# EAGLE design simple-loop-active4 (EAGLE 6.6.0)

## Sheet 1 of 2
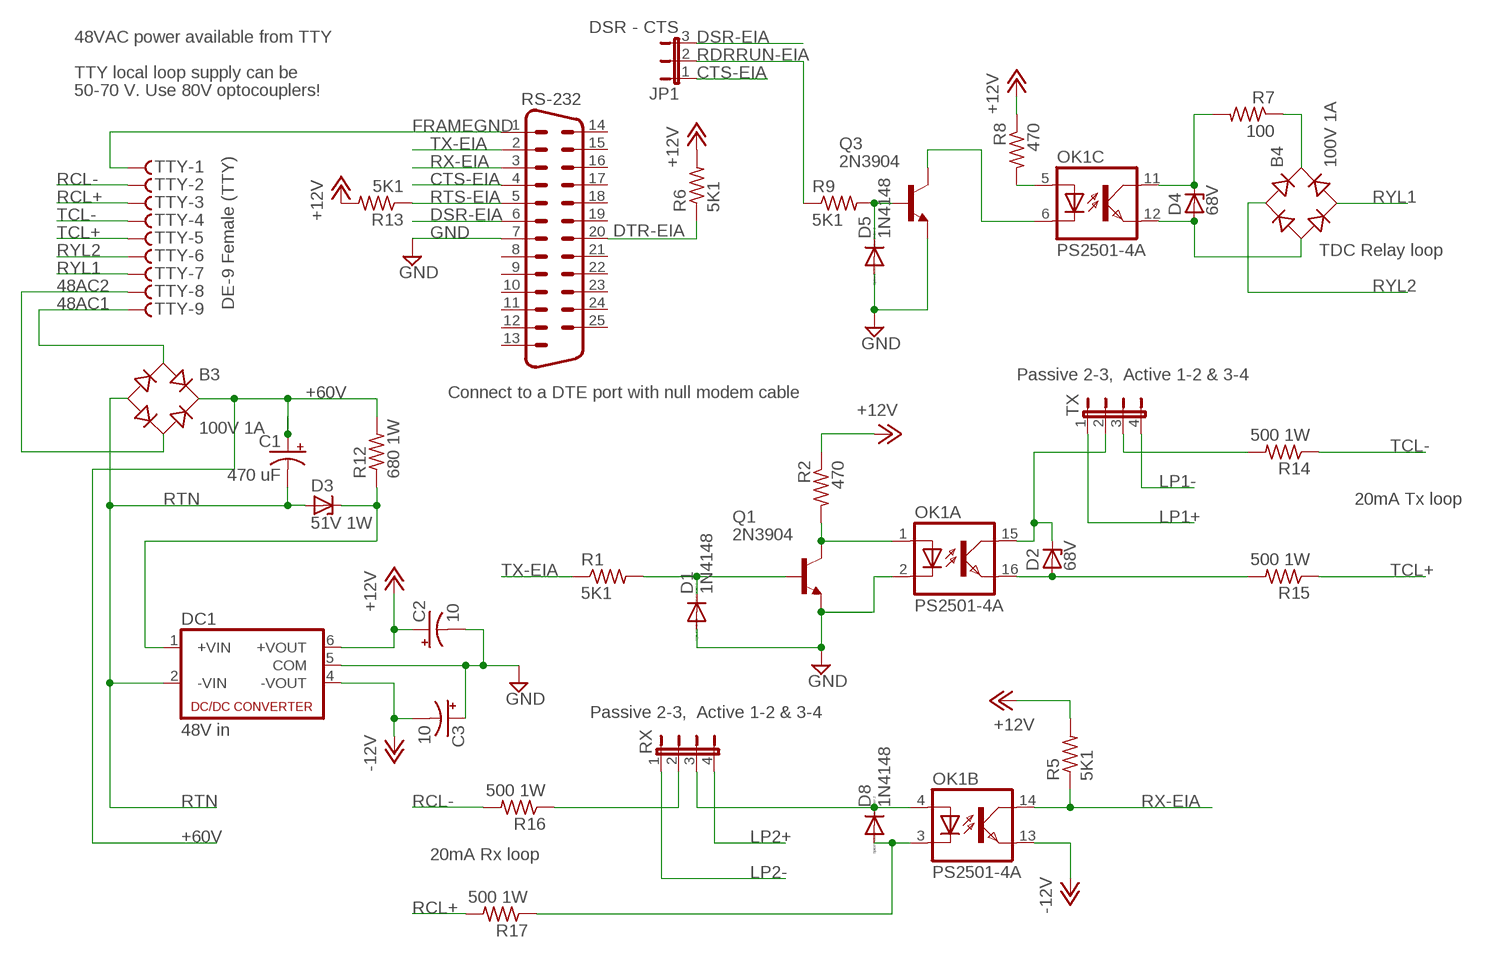
[diagram p0: schematic, sheet 1]

### Parts
B3  100V 1A  RB1A  [RB1A]
B4  100V 1A  RB1A  [RB1A]
C1  470 uF  CPOL-USE7.5-18  [E7,5-18]
C2  10  CPOL-USB45181A  [B45181A]
C3  10  CPOL-USB45181A  [B45181A]
D1  1N4148  1N4148DO35-10  [DO35-10]
D2  68V  ZENER-DIODEDO41Z10  [DO41Z10]
D3  51V 1W  ZENER-DIODEDO41Z10  [DO41Z10]
D4  68V  ZENER-DIODEDO41Z10  [DO41Z10]
D5  1N4148  1N4148DO35-10  [DO35-10]
D8  1N4148  1N4148DO35-10  [DO35-10]
DC1  48V in  NMA  [NMA]
JP1  DSR - CTS  JP2E  [JP2]
OK1  PS2501-4A  ILQ1  [DIL16]
Q1  2N3904  [TO92]
Q3  2N3904  [TO92]
R1  5K1  R-US_0207/10  [0207/10]
R2  470  R-US_0207/10  [0207/10]
R5  5K1  R-US_0207/10  [0207/10]
R6  5K1  R-US_0207/10  [0207/10]
R7  100  R-US_0207/10  [0207/10]
R8  470  R-US_0207/10  [0207/10]
R9  5K1  R-US_0207/10  [0207/10]
R12  680 1W  R-US_0817/7V  [P0817V]
R13  5K1  R-US_0207/10  [0207/10]
R14  500 1W  R-US_0817/7V  [P0817V]
R15  500 1W  R-US_0817/7V  [P0817V]
R16  500 1W  R-US_0817/7V  [P0817V]
R17  500 1W  R-US_0817/7V  [P0817V]
RS-232  M25H  [M25H]
RX  JP4E  [JP4]
TTY  F09HS  [F09H]
TX  JP4E  [JP4]

### Nets
48AC1: B3.AC1 TTY.9
48AC2: B3.AC2 TTY.8
+12V: C2.+ DC1.6(+VOUT) R2.1 R5.2 R6.2 R8.1 R13.2
+48VDC: D3.C DC1.1(+VIN) R12.1
+60V: B3.+ C1.+ R12.2 ; also sheet 2
-12V: C3.- DC1.4(-VOUT) OK1.13(B:EMIT)
CTS-EIA: JP1.1 RS-232.4
DSR-EIA: JP1.3 RS-232.6
DTR-EIA: R6.1 RS-232.20
FRAMEGND: RS-232.1 TTY.1
GND [GND]: C2.- C3.+ D1.A D5.A DC1.5(COM) OK1.2(A:C) Q1.3(E) Q3.3(E) RS-232.7
LP1+: TX.1 ; also sheet 2
LP1-: TX.4 ; also sheet 2
LP2+: RX.4 ; also sheet 2
LP2-: RX.1 ; also sheet 2
N$1: D8.C OK1.4(B:A) RX.3
N$2: R16.1 RX.2
N$3: D8.A OK1.3(B:C) R17.1
N$4: D2.A OK1.16(A:EMIT) R15.2
N$5: OK1.5(C:A) R8.2
N$6: D2.C OK1.15(A:COL) TX.2
N$7: D1.C Q1.2(B) R1.2
N$9: OK1.1(A:A) Q1.1(C) R2.2
N$11: D4.C OK1.11(C:COL) R7.2
N$12: B4.- D4.A OK1.12(C:EMIT)
N$13: B4.+ R7.1
N$15: OK1.6(C:C) Q3.1(C)
N$16: D5.C Q3.2(B) R9.2
N$19: R14.2 TX.3
RCL+: R17.2 TTY.3
RCL-: R16.2 TTY.2
RDRRUN-EIA: JP1.2 R9.1
RTN: B3.- C1.- D3.A DC1.2(-VIN) ; also sheet 2
RTS-EIA: R13.1 RS-232.5
RX-EIA: OK1.14(B:COL) R5.1 RS-232.3
RYL1: B4.AC2 TTY.7
RYL2: B4.AC1 TTY.6
TCL+: R15.1 TTY.5
TCL-: R14.1 TTY.4
TX-EIA: R1.1 RS-232.2
Unconnected: RS-232.8 RS-232.9 RS-232.10 RS-232.11 RS-232.12 RS-232.13 RS-232.14 RS-232.15 RS-232.16 RS-232.17 RS-232.18 RS-232.19 RS-232.21 RS-232.22 RS-232.23 RS-232.24 RS-232.25

### Notes on the sheet
- 48VAC power available from TTY
- TTY local loop supply can be
- 50-70 V. Use 80V optocouplers!
- TDC Relay loop
- DE-9 Female (TTY)
- Passive 2-3,  Active 1-2 & 3-4
- Connect to a DTE port with null modem cable
- 20mA Tx loop
- Passive 2-3,  Active 1-2 & 3-4
- 20mA Rx loop

## Sheet 2 of 2
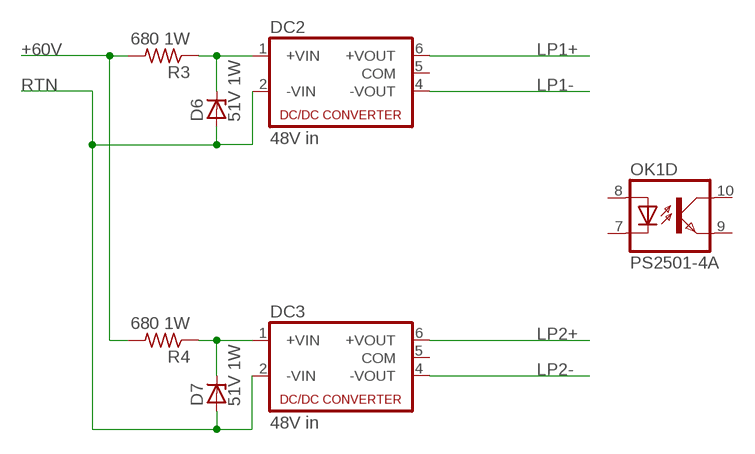
[diagram p1: schematic, sheet 2]

### Parts
D6  51V 1W  ZENER-DIODEDO41Z10  [DO41Z10]
D7  51V 1W  ZENER-DIODEDO41Z10  [DO41Z10]
DC2  48V in  NMA  [NMA]
DC3  48V in  NMA  [NMA]
R3  680 1W  R-US_0817/7V  [P0817V]
R4  680 1W  R-US_0817/7V  [P0817V]

### Nets
+48VDC1: D6.C DC2.1(+VIN) R3.1
+48VDC2: D7.C DC3.1(+VIN) R4.1
+60V: R3.2 R4.2 ; also sheet 1
LP1+: DC2.6(+VOUT) ; also sheet 1
LP1-: DC2.4(-VOUT) ; also sheet 1
LP2+: DC3.6(+VOUT) ; also sheet 1
LP2-: DC3.4(-VOUT) ; also sheet 1
RTN: D6.A D7.A DC2.2(-VIN) DC3.2(-VIN) ; also sheet 1
Unconnected: DC2.5(COM) DC3.5(COM) OK1.7(D:C) OK1.8(D:A) OK1.9(D:EMIT) OK1.10(D:COL)

## Library data of the parts
B3 B4 = rectifier:RB1A: RECTIFIER 1 A
C1-C3 = rcl:CPOL-US: POLARIZED CAPACITOR, American symbol
D1 D5 D8 = diode:1N4148: DIODE high speed (Philips)
D2-D4 D6 D7 = diode:ZENER-DIODE: Z-Diode
DC1-DC3 = dc-dc-converter:NMA: DC-DC CONVERTER; MF: C & D TECHNOLOGIES, INC; MPN: NMA0515SC; OC_FARNELL: 1021434; OC_NEWARK: 61K3064
JP1 = jumper:JP2E: JUMPER
OK1 = optocoupler:ILQ1: SIEMENS OPTO COUPLER; MF: VISHAY/TELEFUNKEN; MPN: ILQ1; OC_FARNELL: 1469501; OC_NEWARK: 88K1954
Q1 Q3 = transistor-npn:2N3904: NPN Transistor
R1-R9 R12-R17 = rcl:R-US_: RESISTOR, American symbol
RS-232 = con-subd:M25: SUB-D; OC_FARNELL: unknown; OC_NEWARK: unknown
RX TX = jumper:JP4E: JUMPER
TTY = con-subd:F09?S: SUB-D; OC_FARNELL: unknown; OC_NEWARK: unknown

## Net classes
1 GND: width 0.508 mm

## Board
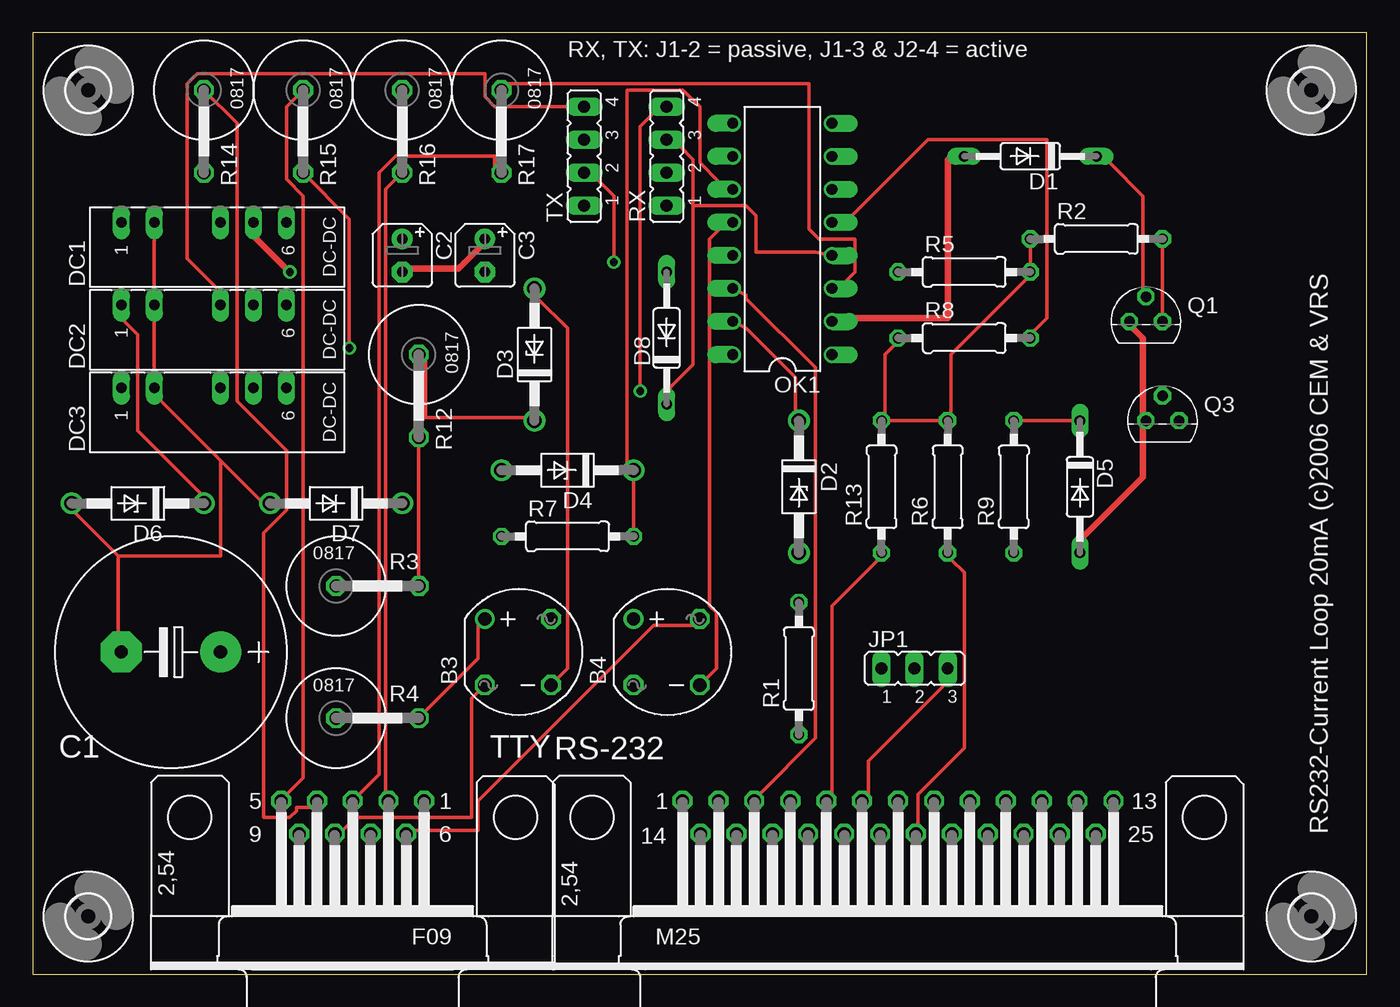
[diagram p2: board, top side]
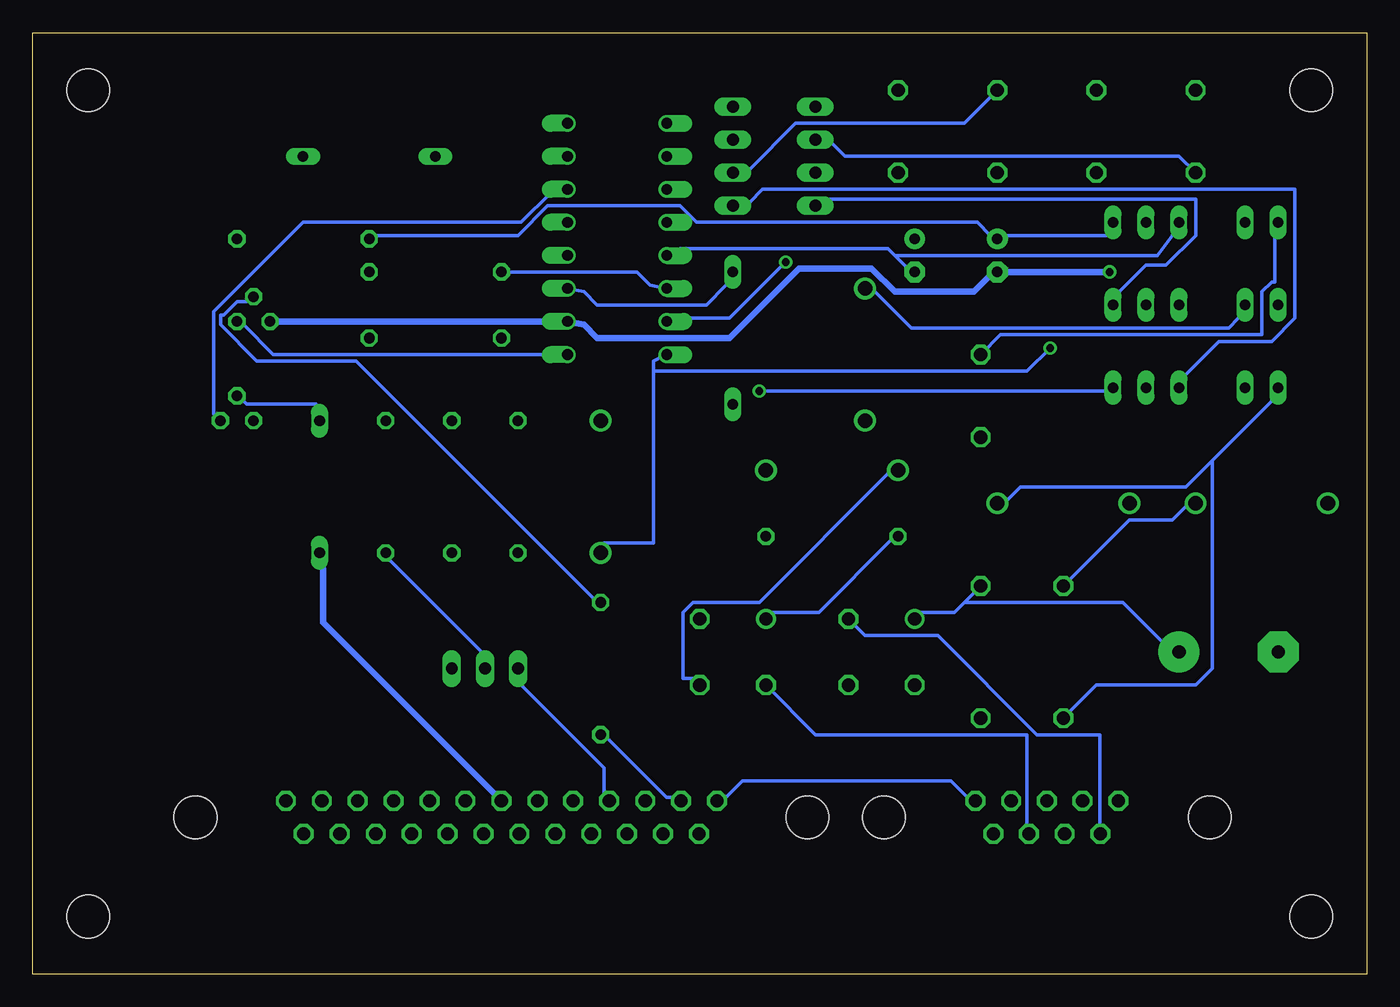
[diagram p3: board, bottom side, seen from below]

Size 102.54 x 72.37 mm. Coordinates in mm from the lower left corner, seen from the top.
Outline: 102.54,0 102.54,72.37 0,72.37 0,0 102.54,0
Copper layers (1*16): Top 0.035mm / dielectric 1.5mm / Bottom 0.035mm
Design rules "10mils *": minimum track width 10mil, minimum drill 24mil, track to track 10mil, track to pad 10mil, pad to pad 10mil, via to via 10mil, smd to smd 10mil, copper to edge 40mil, drill to drill 10mil, minimum pad ring 10mil, minimum via ring 8mil, stop-mask expansion 0mil, vias tented up to drill 0mil, thermal gap 10mil

### Footprints (pad centres in the part's own frame; a part is rotated, then mirrored left to right if it is on the bottom)
RB1A = drill 1.016: + -2.54,2.54 | drill 1.016 octagon: - 2.54,-2.54; AC1 2.54,2.54; AC2 -2.54,-2.54
E7,5-18 = drill 1.016 pad 3.15: + -3.81,0 | drill 1.016 pad 3.15 octagon: - 3.81,0
B45181A = drill 0.813 pad 1.6: + -1.27,0 | drill 0.813 pad 1.6 octagon: - 1.27,0
DO35-10 = drill 0.813 long: A 5.08,0; C -5.08,0
DO41Z10 = drill 1.118: A 5.08,0; C -5.08,0
NMA = drill 0.813 long: 1 0,6.35; 2 0,3.81; 4 0,-1.27; 5 0,-3.81; 6 0,-6.35
JP2 = drill 0.914 long: 1 -2.54,0; 2 0,0; 3 2.54,0
DIL16 = drill 0.813 offset: 1 -8.89,-3.81; 2 -6.35,-3.81; 3 -3.81,-3.81; 4 -1.27,-3.81; 5 1.27,-3.81; 6 3.81,-3.81; 7 6.35,-3.81; 8 8.89,-3.81; 9 8.89,3.81; 10 6.35,3.81; 11 3.81,3.81; 12 1.27,3.81; 13 -1.27,3.81; 14 -3.81,3.81; 15 -6.35,3.81; 16 -8.89,3.81
TO92 = drill 0.813 octagon: 1 1.27,0; 2 0,1.905; 3 -1.27,0
0207/10 = drill 0.813 octagon: 1 -5.08,0; 2 5.08,0
P0817V = drill 1.016 octagon: 1 -5.08,0; 2 1.27,0
M25H = drill 1.016 octagon: 1 -16.561,1.27; 2 -13.792,1.27; 3 -11.049,1.27; 4 -8.28,1.27; 5 -5.512,1.27; 6 -2.769,1.27; 7 0,1.27; 8 2.769,1.27; 9 5.512,1.27; 10 8.28,1.27; 11 11.049,1.27; 12 13.792,1.27; 13 16.561,1.27; 14 -15.189,-1.27; 15 -12.421,-1.27; 16 -9.652,-1.27; 17 -6.909,-1.27; 18 -4.14,-1.27; 19 -1.372,-1.27; 20 1.372,-1.27; 21 4.14,-1.27; 22 6.909,-1.27; 23 9.652,-1.27; 24 12.421,-1.27; 25 15.189,-1.27 | hole 3.302: 23.52,0; -23.52,0
JP4 = drill 0.914 long: 1 -3.81,0; 2 -1.27,0; 3 1.27,0; 4 3.81,0
F09H = drill 1.016 octagon: 1 -5.486,-1.27; 2 -2.743,-1.27; 3 0,-1.27; 4 2.743,-1.27; 5 5.486,-1.27; 6 -4.115,1.27; 7 -1.372,1.27; 8 1.372,1.27; 9 4.115,1.27 | hole 3.302: -12.522,0; 12.522,0
3,3 = hole 3.3: 0,0

### Placement (x,y rotation side)
B3  37.3,24.76 0 top
B4  48.73,24.76 0 top
C1  10.63,24.76 180 top
C2  28.41,55.24 270 top
C3  34.76,55.24 270 top
D1  76.67,62.86 180 top
D2  58.89,37.46 270 top
D3  38.57,47.62 90 top
D4  41.11,38.73 180 top
D5  80.48,37.46 270 top
D6  8.09,36.19 180 top
D7  23.33,36.19 180 top
D8  48.73,48.89 90 top
DC1  13.17,57.78 90 top
DC2  13.17,51.43 90 top
DC3  13.17,45.08 90 top
JP1  67.78,23.49 0 top
OK1  57.62,56.51 90 top
Q1  85.56,50.16 0 top
Q3  86.83,42.54 0 top
R1  58.89,23.49 90 top
R2  81.75,56.51 0 top
R3  28.41,29.84 0 top
R4  28.41,19.68 0 top
R5  71.59,53.97 0 top
R6  70.32,37.46 90 top
R7  41.11,33.65 0 top
R8  71.59,48.89 0 top
R9  75.4,37.46 90 top
R12  29.68,42.54 270 top
R13  65.24,37.46 90 top
R14  13.17,62.86 270 top
R15  20.79,62.86 270 top
R16  28.41,62.86 270 top
R17  36.03,62.86 270 top
RS-232  66.51,12.06 0 top
RX  48.73,62.86 90 top
TTY  24.6,12.06 180 top
TX  42.38,62.86 90 top
U$1  [3,3]  4.28,67.94 0 top
U$2  [3,3]  4.28,4.44 0 top
U$3  [3,3]  98.26,67.94 0 top
U$4  [3,3]  98.26,4.44 0 top

### Tracks (layer width: path | path; a pad name or v marks a point on that pad's centre or on a via)
48AC1
  Bottom 0.254: TTY.9 20.54,11.3 20.54,18.41 25.36,18.41 32.98,26.03 38.57,26.03 B3.AC1
48AC2
  Top 0.254: TTY.8 23.84,11.04 24.85,12.06 33.74,12.06 33.74,21.2 B3.AC2
+12V
  Top 0.254: R2.1 R5.2 76.42,53.46 70.57,47.62 70.57,43.05 R6.2 R13.2 65.49,43.05 65.49,47.62 66.26,48.38 R8.1
  Bottom 0.254: DC1.6 20.03,56.76 27.9,56.76 C2.+ 28.92,56.76 29.93,57.78 51.52,57.78 52.79,59.05 62.95,59.05 65.24,56.76 76.16,56.76 R2.1
+48VDC
  Top 0.254: D3.C 37.81,42.79 30.19,42.79 30.19,47.11 R12.1
  Bottom 0.254: DC1.1 7.07,56.51 7.07,53.21 7.33,53.21 8.09,52.45 8.09,49.14 28.16,49.14 R12.1
+48VDC1
  Top 0.254: DC2.1 7.07,50.16 8.09,49.14 8.09,41.78 12.92,36.95 D6.C
  Bottom 0.254: R3.1 18.25,34.92 14.95,34.92 13.93,35.94 D6.C
+48VDC2
  Bottom 0.254: 11.9,39.49 13.93,37.46 26.63,37.46 27.65,36.44 D7.C | 11.9,39.49 7.33,44.06 DC3.1 | 11.9,39.49 11.9,23.49 13.17,22.22 20.79,22.22 R4.1
+60V
  Top 0.254: R4.2 34.25,24.25 34.25,26.79 B3.+ | R3.2 R12.2
  Bottom 0.254: 30.95,28.57 31.71,27.81 34.25,27.81 B3.+ | 30.95,28.57 R3.2 | 30.95,28.57 18.76,28.57 15.2,25.01 C1.+
-12V
  Bottom 0.254: 36.28,55.24 36.79,55.75 52.79,55.75 OK1.13 | 36.28,55.24 35.27,54.22 C3.- | 36.28,55.24 16.09,55.24 14.95,56.76 DC1.4
CTS-EIA
  Bottom 0.254: JP1.1 64.99,22.22 58.64,15.87 58.64,13.84 RS-232.4
DSR-EIA
  Top 0.254: JP1.3 70.07,22.22 64.22,16.38 64.22,13.84 RS-232.6
DTR-EIA
  Top 0.254: R6.1 70.57,31.87 71.59,30.86 71.59,17.39 68.03,13.84 68.03,11.3 RS-232.20
FRAMEGND
  Bottom 0.254: TTY.1 30.7,13.58 31.97,14.85 47.97,14.85 49.24,13.58 RS-232.1
GND  (via drill 0.61)
  Top 0.508: D5.A 80.73,33.65 85.31,38.22 85.31,42.03 Q3.3 85.31,43.05 85.31,48.89 84.54,49.65 Q1.3 | C2.- 28.92,54.22 32.73,54.22 34.51,56 C3.+ | v19.77,53.97 17.23,56.51 DC1.5 | OK1.2 62.7,50.41 70.32,50.41 70.32,62.61 D1.A
  Bottom 0.508: RS-232.7 80.23,27.05 80.23,31.11 D5.A | v19.77,53.97 C2.- 28.92,53.72 30.19,52.45 36.28,52.45 38.06,54.22 43.65,54.22 48.98,48.89 59.14,48.89 60.16,49.91 OK1.2 Q1.3
LP1+
  Bottom 0.254: DC2.6 19.01,52.45 16.98,54.48 15.46,54.48 13.17,56.76 13.17,59.56 41.36,59.56 TX.1
LP1-
  Top 0.254: DC2.4 14.19,52.7 11.9,54.99 11.9,68.45 12.66,69.21 34.76,69.21 34.76,67.43 35.52,66.67 TX.4
LP2+  (via drill 0.61)
  Top 0.254: v46.7,44.83 46.7,65.15 47.71,66.16 RX.4
  Bottom 0.254: v46.7,44.83 20.03,44.83 DC3.6
LP2-
  Bottom 0.254: DC3.4 13.93,46.1 11.39,48.64 7.33,48.64 5.55,50.41 5.55,60.32 46.44,60.32 47.46,59.3 RX.1
N$1
  Top 0.254: 50.76,59.05 50.76,62.61 49.75,63.62 RX.3 | 50.76,59.05 50.76,46.86 48.98,45.08 D8.C | 50.76,59.05 54.83,59.05 55.59,58.29 55.59,55.49 60.16,55.49 OK1.4
N$2
  Bottom 0.254: RX.2 47.46,61.84 43.9,65.4 30.95,65.4 R16.1
N$3
  Top 0.254: R17.1 36.54,68.45 59.65,68.45 59.65,57.27 60.41,56.51 63.21,56.51 63.21,53.97 62.45,53.21 OK1.3
  Bottom 0.254: D8.A 49.24,52.95 50.76,51.43 59.14,51.43 60.16,52.45 OK1.3
N$4  (via drill 0.61)
  Top 0.254: v24.35,48.13 24.35,58.03 R15.2
  Bottom 0.254: 54.83,46.35 54.83,33.14 58.64,33.14 D2.A | 54.83,46.35 54.83,47.11 OK1.16 | v24.35,48.13 26.12,46.35 54.83,46.35
N$5
  Top 0.254: OK1.5 62.7,58.03 68.8,64.13 77.94,64.13 77.94,50.41 76.92,49.4 R8.2
N$6  (via drill 0.61)
  Top 0.254: OK1.15 54.83,49.65 58.64,45.84 58.64,43.3 D2.C | v44.67,54.73 44.67,59.81 43.4,61.08 TX.2
  Bottom 0.254: v44.67,54.73 48.98,50.41 52.54,50.41 OK1.15
N$7
  Top 0.254: D1.C 82.77,62.35 85.31,59.81 85.31,52.7 Q1.2
  Bottom 0.254: R1.2 59.4,28.82 77.69,47.11 85.31,47.11 88.1,49.91 88.1,50.67 87.85,50.67 86.83,51.68 86.07,51.68 Q1.2
N$9
  Top 0.254: Q1.1 R2.2
  Bottom 0.254: OK1.1 84.04,47.62 86.32,49.91 Q1.1
N$11
  Top 0.254: R7.2 D4.C 45.68,39.24 45.68,67.94 50,67.94 51.27,66.67 51.27,62.35 52.79,60.83 OK1.11
N$12
  Top 0.254: OK1.12 52.79,57.27 52.03,56.51 52.03,28.32 52.54,27.81 52.54,23.49 B4.-
  Bottom 0.254: D4.A 36.79,38.48 46.7,28.57 51.78,28.57 52.54,27.81 52.54,22.73 51.78,22.73 B4.-
N$13
  Bottom 0.254: R7.1 36.54,33.4 42.13,27.81 45.68,27.81 B4.+
N$15
  Bottom 0.254: OK1.6 62.7,60.07 64.99,57.78 81.75,57.78 88.61,50.92 88.61,43.05 88.35,43.05 Q3.1
N$16
  Top 0.254: R9.2 D5.C
  Bottom 0.254: Q3.2 86.32,44.06 86.07,43.81 80.73,43.81 D5.C
N$19
  Bottom 0.254: TX.3 41.11,63.88 40.09,62.86 14.44,62.86 R14.2
RCL+
  Top 0.254: TTY.3 26.63,15.36 26.63,61.59 27.9,62.86 35.52,62.86 35.52,62.1 R17.2
RCL-
  Top 0.254: TTY.2 27.14,13.84 27.14,60.32 R16.2
RDRRUN-EIA
  Bottom 0.254: R9.1 75.15,31.87 68.03,24.76 JP1.2
RTN
  Top 0.254: B3.- 41.11,23.49 41.11,49.65 38.82,51.94 D3.A | 6.57,32.13 3.26,35.43 D6.A | 6.57,32.13 6.57,25.52 C1.- | DC1.2 DC2.2 DC3.2 9.87,44.06 14.44,39.49 | 14.44,39.49 17.49,36.44 D7.A | 6.57,32.13 14.44,32.13 14.44,39.49
  Bottom 0.254: D3.A 37.81,52.45 35.01,49.65 10.63,49.65 9.87,50.41 DC2.2
RTS-EIA
  Top 0.254: R13.1 64.99,31.87 61.43,28.32 61.43,13.84 RS-232.5
RX-EIA
  Top 0.254: RS-232.3 55.84,13.84 60.16,18.16 60.16,46.6 54.83,51.94 54.83,52.19 OK1.14
  Bottom 0.254: OK1.14 55.08,52.95 56.1,53.97 R5.1
RYL1
  Bottom 0.254: TTY.7 26.12,11.3 26.12,18.41 42.38,18.41 B4.AC2
RYL2
  Top 0.254: TTY.6 29.43,11.04 34.25,11.04 34.25,13.33 47.71,26.79 50.76,26.79 B4.AC1
TCL+
  Top 0.254: TTY.5 19.52,13.84 20.79,15.11 20.79,59.81 19.52,61.08 19.52,66.67 R15.1
TCL-
  Top 0.254: TTY.4 21.3,12.82 20.28,12.82 20.28,12.57 19.77,12.06 17.74,12.06 17.74,33.9 19.52,35.68 19.52,40.25 15.71,44.06 15.71,65.4 R14.1
TX-EIA
  Bottom 0.254: R1.1 58.38,18.16 53.81,13.58 53.3,13.58 RS-232.2

### Text on the board
tNames: RX, TX: J1-2 = passive, J1-3 & J2-4 = active | RS232-Current Loop 20mA (c)2006 CEM & VRS